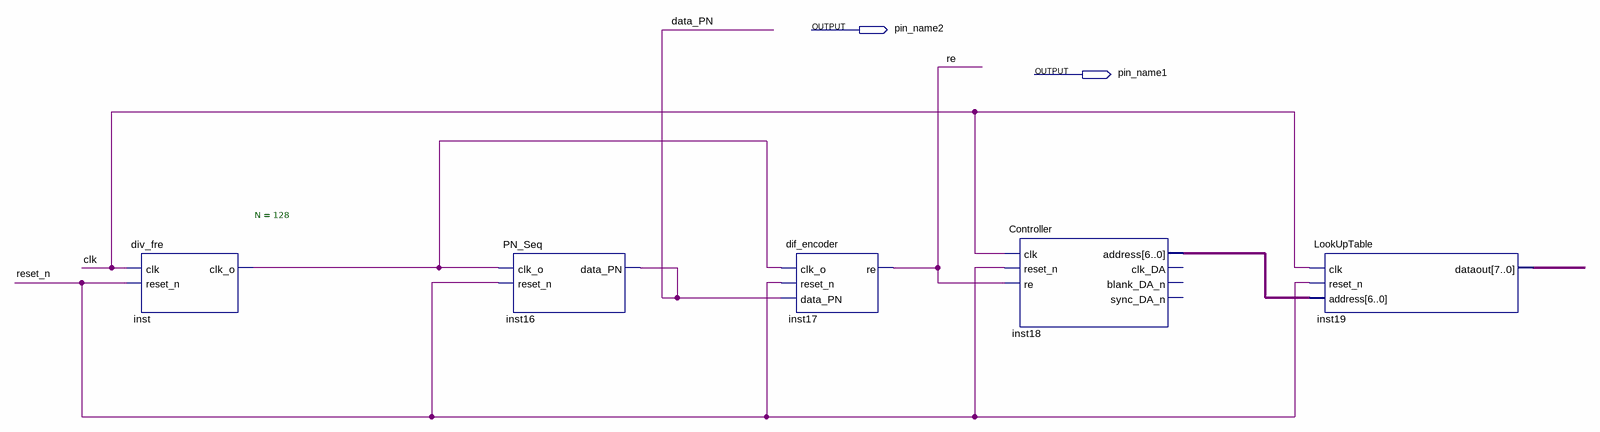
[diagram p0: schematic sheet]
// Quartus schematic Block1.bdf as structural Verilog: 5 symbols, 2 pins
module Block1 (
  output pin_name2,
  output pin_name1
);

  wire clk, data_PN, inst_clk_o, re, reset_n;
  wire [6:0] inst18_address;
  wire [7:0] inst19_dataout;

  div_fre #(.N(128)) inst (.clk(clk), .reset_n(reset_n), .clk_o(inst_clk_o));
  PN_Seq inst16 (.clk_o(inst_clk_o), .reset_n(reset_n), .data_PN(data_PN));
  dif_encoder inst17 (.clk_o(inst_clk_o), .reset_n(reset_n), .data_PN(data_PN), .re(re));
  Controller inst18 (
    .clk(clk), .reset_n(reset_n), .re(re), .address(inst18_address));  // open: clk_DA, blank_DA_n, sync_DA_n
  LookUpTable inst19 (.clk(clk), .reset_n(reset_n), .address(inst18_address), .dataout(inst19_dataout));
endmodule
